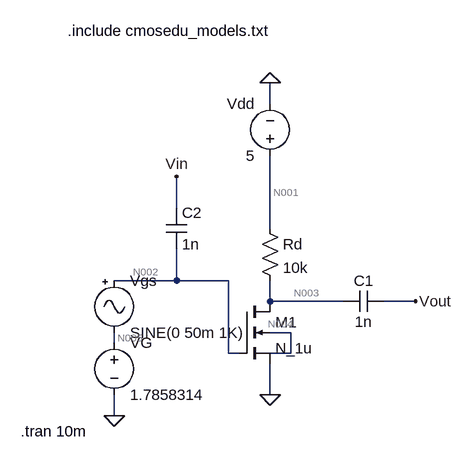
[diagram p0: schematic Parte6.asc]
Parte6.asc, the LTspice schematic file:
Version 4
SHEET 1 880 680
WIRE 144 -176 144 -208
WIRE 0 -16 0 -64
WIRE 144 16 144 -96
WIRE 0 96 0 48
WIRE 0 96 -96 96
WIRE 80 96 0 96
WIRE 144 128 144 96
WIRE 256 128 144 128
WIRE 368 128 320 128
WIRE 176 176 144 176
WIRE -96 192 -96 176
WIRE 80 208 80 96
WIRE 96 208 80 208
WIRE 176 208 176 176
WIRE 176 208 144 208
WIRE 144 272 144 224
WIRE -96 304 -96 272
FLAG 144 272 0
FLAG 368 128 Vout
FLAG 144 -208 0
FLAG -96 304 0
FLAG 0 -64 Vin
SYMBOL nmos4 96 128 R0
SYMATTR InstName M1
SYMATTR Value N_1u
SYMATTR Value2 l=1.5u w=9.23u
SYMBOL res 128 0 R0
SYMATTR InstName Rd
SYMATTR Value 10k
SYMBOL voltage -96 176 R0
SYMATTR InstName VG
SYMATTR Value 1.7858314
SYMBOL voltage 144 -80 R180
WINDOW 0 24 96 Left 2
WINDOW 3 24 16 Left 2
SYMATTR InstName Vdd
SYMATTR Value 5
SYMBOL Misc\\signal -96 80 R0
WINDOW 123 0 0 Left 2
WINDOW 39 0 0 Left 2
SYMATTR InstName Vgs
SYMATTR Value SINE(0 50m 1K)
SYMBOL cap 320 112 R90
WINDOW 0 0 32 VBottom 2
WINDOW 3 32 32 VTop 2
SYMATTR InstName C1
SYMATTR Value 1n
SYMBOL cap -16 -16 R0
SYMATTR InstName C2
SYMATTR Value 1n
TEXT -168 -288 Left 2 !.include cmosedu_models.txt
TEXT -240 328 Left 2 !.tran 10m

The netlist it stands for:
* Parte6.asc
M1 N003 N002 0 N004 N_1u l=1.5u w=9.23u
Rd N001 N003 10k
VG N005 0 1.7858314
Vdd N001 0 5
Vgs N002 N005 SINE(0 50m 1K)
C1 Vout N003 1n
C2 Vin N002 1n
.model NMOS NMOS
.model PMOS PMOS
.lib standard.mos
.include cmosedu_models.txt
.tran 10m
.backanno
.end

* Results of the author's LTspice run, read from the files saved beside the schematic
* Operating Point, zero values left out:
*   V(n003) = 2.313 V
*   V(n002) = 1.786 V
*   V(n004) = 137.8 mV
*   V(n001) = 5 V
*   V(n005) = 1.786 V
*   Id(M1) = 268.7 µA
*   Is(M1) = -268.7 µA
*   I(Rd) = 268.7 µA
*   I(Vdd) = -268.7 µA
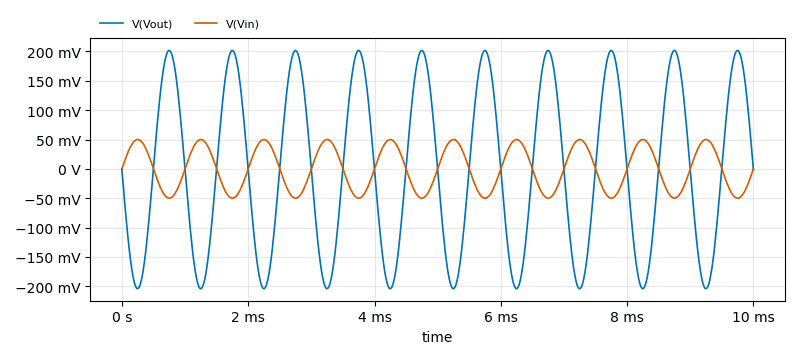
[diagram p1: Transient Analysis of Parte6.asc, plotted from the saved traces]
* Transient Analysis, 1 run:
*   V(Vout): min -204.3 mV, max 201.8 mV, average -521 µV, rms 143.6 mV, last -1.96 mV
*   V(Vin): min -49.95 mV, max 49.95 mV, average -32.58 nV, rms 35.33 mV, last 0 V